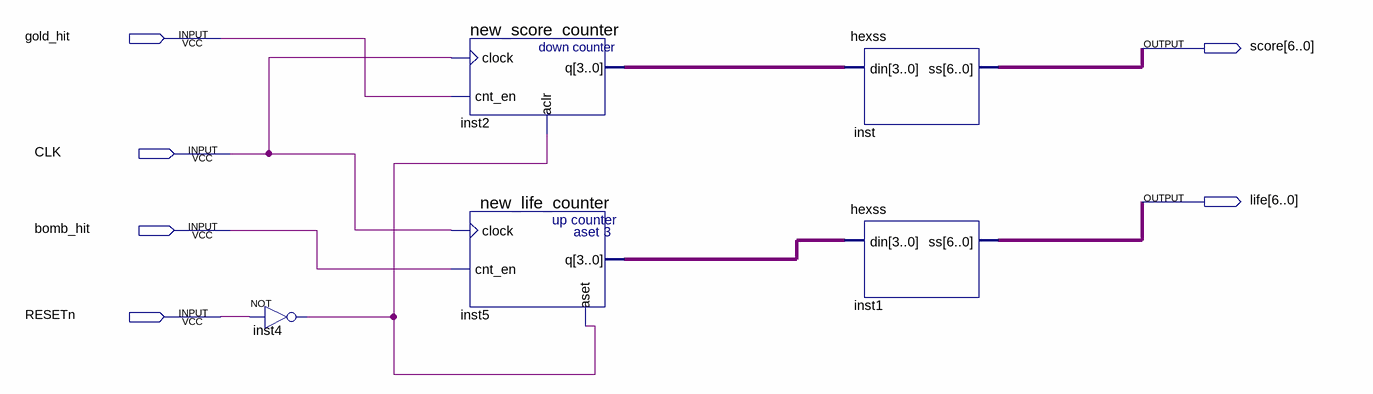
[diagram p0: schematic sheet]
// Quartus schematic score_module.bdf as structural Verilog: 5 symbols, 6 pins
module score_module (
  input  gold_hit,
  input  CLK,
  input  bomb_hit,
  input  RESETn,
  output [6:0] score,
  output [6:0] life
);

  wire inst4_out;
  wire [3:0] inst2_q, inst5_q;

  not inst4 (inst4_out, RESETn);
  new_score_counter inst2 (.clock(CLK), .cnt_en(gold_hit), .aclr(inst4_out), .q(inst2_q));
  new_life_counter inst5 (.clock(CLK), .cnt_en(bomb_hit), .aset(inst4_out), .q(inst5_q));
  hexss inst (.din(inst2_q), .ss(score));
  hexss inst1 (.din(inst5_q), .ss(life));
endmodule
